# Altium project SAMV71_tito_shield.PrjPcb
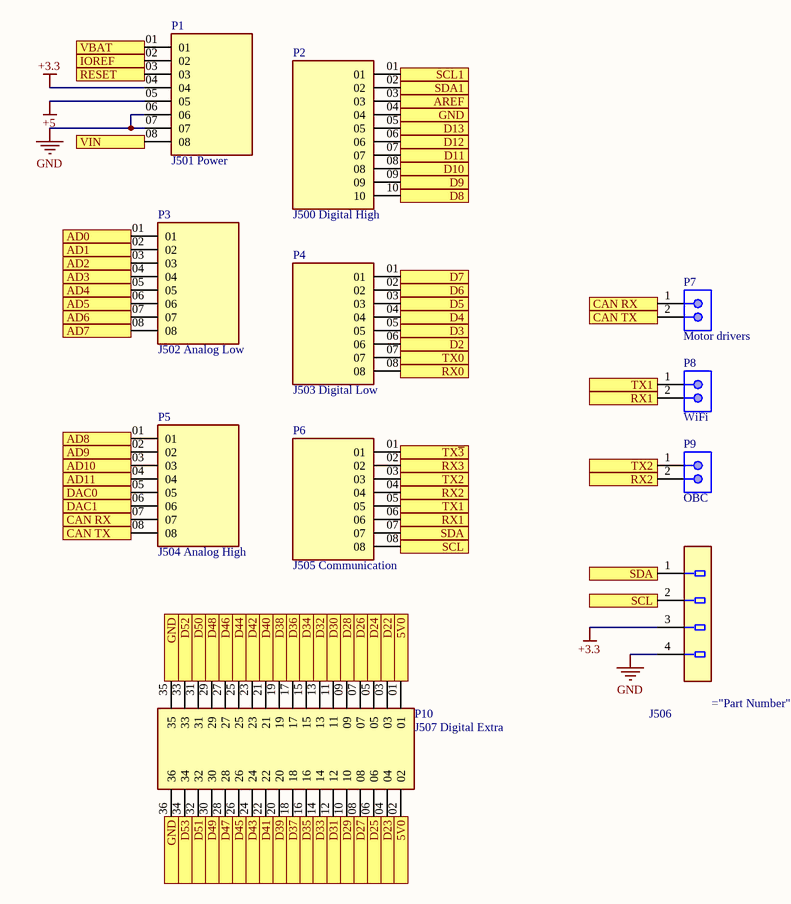
[diagram p0: SAMV71_tito_shield.SchDoc]
1 sheet, 11 parts. Net scope: flat (ports and power ports of the same name join across sheets).
Board file: SAMV71_tito_shield.PcbDoc

## Sheet SAMV71_tito_shield.SchDoc: SAMV71 Shield
size A; SheetNumber: 1; SheetTotal: 1

### Parts
J506  (no value)  [Molex_22-27-2041_0]
P1  J501 Power  [SAMTEC_TSW-108-07-G-S]
P2  J500 Digital High  [PCBComponent_1]
P3  J502 Analog Low  [SAMTEC_TSW-108-07-G-S]
P4  J503 Digital Low  [SAMTEC_TSW-108-07-G-S]
P5  J504 Analog High  [SAMTEC_TSW-108-07-G-S]
P6  J505 Communication  [SAMTEC_TSW-108-07-G-S]
P7  Motor drivers  [MOLX-22-23-2021_V]
P8  WiFi  [MOLX-22-23-2021_V]
P9  OBC  [MOLX-22-23-2021_V]
P10  J507 Digital Extra  [SAMTEC_TSW-118-07-G-D]

### Ports
5V0, AD0, AD1, AD2, AD3, AD4, AD5, AD6, AD7, AD8, AD9, AD10, AD11, AREF, CAN RX, CAN TX, D2, D3, D4, D5, D6, D7, D8, D9, D10, D11, D12, D13, D22, D23, D24, D25, D26, D27, D28, D29, D30, D31, D32, D33, D34, D35, D36, D37, D38, D39, D40, D41, D42, D43, D44, D45, D46, D47, D48, D49, D50, D51, D52, D53, DAC0, DAC1, GND, IOREF, RESET, RX0, RX1, RX2, RX3, SCL, SCL1, SDA, SDA1, TX0, TX1, TX2, TX~{3}, VBAT, VIN

### Nets
+3.3: J506.3 P1.04
+5: P1.05
GND: J506.4 P1.06 P1.07
NetJ506_1: J506.1 P6.07 ; port SDA
NetJ506_2: J506.2 P6.08 ; port SCL
NetP1_01: P1.01 ; port VBAT
NetP1_02: P1.02 ; port IOREF
NetP1_03: P1.03 ; port RESET
NetP1_08: P1.08 ; port VIN
NetP2_01: P2.01 ; port SCL1
NetP2_02: P2.02 ; port SDA1
NetP2_03: P2.03 ; port AREF
NetP2_04: P2.04 P10.35 P10.36 ; port GND
NetP2_05: P2.05 ; port D13
NetP2_06: P2.06 ; port D12
NetP2_07: P2.07 ; port D11
NetP2_08: P2.08 ; port D10
NetP2_09: P2.09 ; port D9
NetP2_10: P2.10 ; port D8
NetP3_01: P3.01 ; port AD0
NetP3_02: P3.02 ; port AD1
NetP3_03: P3.03 ; port AD2
NetP3_04: P3.04 ; port AD3
NetP3_05: P3.05 ; port AD4
NetP3_06: P3.06 ; port AD5
NetP3_07: P3.07 ; port AD6
NetP3_08: P3.08 ; port AD7
NetP4_01: P4.01 ; port D7
NetP4_02: P4.02 ; port D6
NetP4_03: P4.03 ; port D5
NetP4_04: P4.04 ; port D4
NetP4_05: P4.05 ; port D3
NetP4_06: P4.06 ; port D2
NetP4_07: P4.07 ; port TX0
NetP4_08: P4.08 ; port RX0
NetP5_01: P5.01 ; port AD8
NetP5_02: P5.02 ; port AD9
NetP5_03: P5.03 ; port AD10
NetP5_04: P5.04 ; port AD11
NetP5_05: P5.05 ; port DAC0
NetP5_06: P5.06 ; port DAC1
NetP5_07: P5.07 P7.1 ; port CAN RX
NetP5_08: P5.08 P7.2 ; port CAN TX
NetP6_01: P6.01 ; port TX~{3}
NetP6_02: P6.02 ; port RX3
NetP6_03: P6.03 P9.1 ; port TX2
NetP6_04: P6.04 P9.2 ; port RX2
NetP6_05: P6.05 P8.1 ; port TX1
NetP6_06: P6.06 P8.2 ; port RX1
NetP10_01: P10.01 P10.02 ; port 5V0
NetP10_03: P10.03 ; port D22
NetP10_04: P10.04 ; port D23
NetP10_05: P10.05 ; port D24
NetP10_06: P10.06 ; port D25
NetP10_07: P10.07 ; port D26
NetP10_08: P10.08 ; port D27
NetP10_09: P10.09 ; port D28
NetP10_10: P10.10 ; port D29
NetP10_11: P10.11 ; port D30
NetP10_12: P10.12 ; port D31
NetP10_13: P10.13 ; port D32
NetP10_14: P10.14 ; port D33
NetP10_15: P10.15 ; port D34
NetP10_16: P10.16 ; port D35
NetP10_17: P10.17 ; port D36
NetP10_18: P10.18 ; port D37
NetP10_19: P10.19 ; port D38
NetP10_20: P10.20 ; port D39
NetP10_21: P10.21 ; port D40
NetP10_22: P10.22 ; port D41
NetP10_23: P10.23 ; port D42
NetP10_24: P10.24 ; port D43
NetP10_25: P10.25 ; port D44
NetP10_26: P10.26 ; port D45
NetP10_27: P10.27 ; port D46
NetP10_28: P10.28 ; port D47
NetP10_29: P10.29 ; port D48
NetP10_30: P10.30 ; port D49
NetP10_31: P10.31 ; port D50
NetP10_32: P10.32 ; port D51
NetP10_33: P10.33 ; port D52
NetP10_34: P10.34 ; port D53

### Library data of the parts
J506 = 22-27-2041
P1 P3-P6 = TSW-108-07-G-S: MF: Samtec; Availability: Unavailable; Package: None; MP: TSW-108-07-G-S; Value: *; Price: None
P2 = Component_1
P7-P9 = 22-23-2021: Male Header, Pitch 2.54 mm, 1 x 2 Position, Height 10.67 mm, Tail Length 3.56 mm, 0 to 75 degC, RoHS, Bulk; Series name: 6373; Rated Voltage: 250V; Wire connection method: Solder; Rated current: 4/ContactA; Number of poles: 2; Contact point finish: Tin Over Copper; Maximum service temperature: 75C; Number of arrays: 1; Minimum service temperature: 0C; Shape/Type: Straight; Pitch: 2.54mm; Width: 6.35mm; PartNumber: 22-23-2021; ComponentLink1Description: Manufacturer URL; ComponentLink2Description: Datasheet; ComponentLink1URL: http://www.molex.com/; ComponentLink2URL: https://datasheet.ciiva.com/19454/232266-19454304.pdf; Length: 5.08mm; Height: 10.67mm; Mounting Technology: Through Hole; PackageDescription: Male Header, Pitch 2.54 mm, 1 x 2 Position, Height 10.67 mm, Tail Length 3.56 mm
P10 = TSW-118-07-G-D: MF: Samtec Inc.; Availability: Unavailable; Price: None; Value: *; MP: TSW-118-07-G-D; Package: None